# Altium schematic sheet Opto_inputs.SchDoc
size A4; SheetNumber: 2; SheetTotal: 8
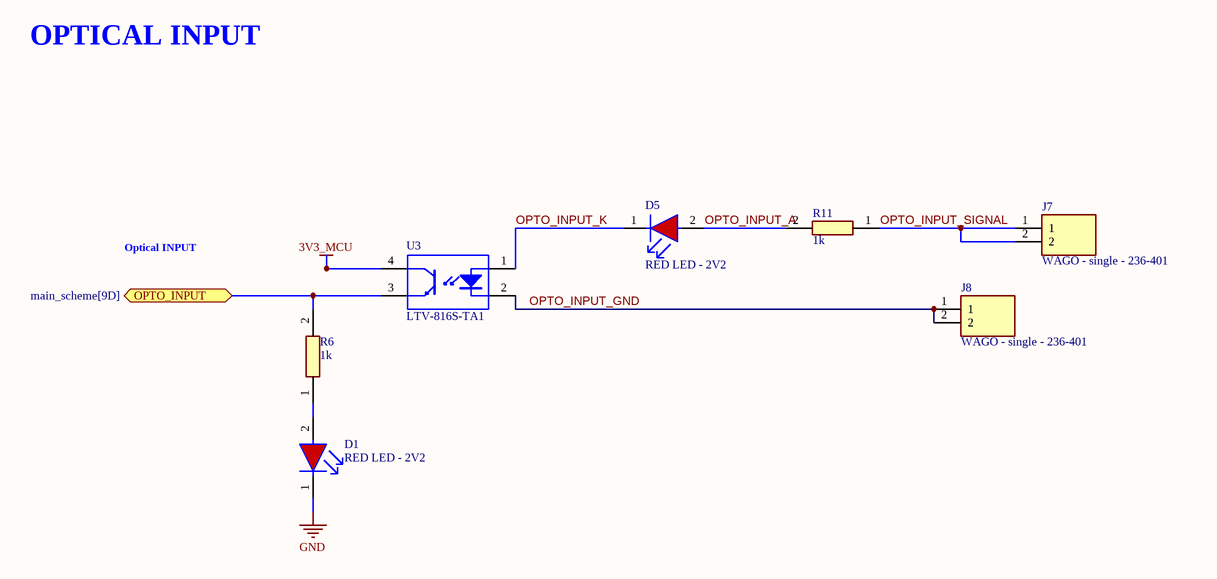
[diagram p0: Opto_inputs.SchDoc]

## Parts
D1  RED LED - 2V2  [0603_RED_LED]
D5  RED LED - 2V2  [0603_RED_LED]
J7  WAGO - single - 236-401  [WAGO-236-601]
J8  WAGO - single - 236-401  [WAGO-236-601]
R6  1k  [0603- SMD resistor]
R11  1k  [0603- SMD resistor]
U3  LTV-816S-TA1  [LTST-LTV-816S_V]

## Ports
OPTO_INPUT (bidir, see main_scheme[9D])

## Nets
3V3_MCU: U3.4(COLLECTOR)
GND: D1.1(C)
OPTO_INPUT: R6.2 U3.3(EMITTER) ; port OPTO_INPUT
OPTO_INPUT_A: D5.2(A) R11.2
OPTO_INPUT_GND: J8.1 J8.2 U3.2(CATHODE)
OPTO_INPUT_K: D5.1(C) U3.1(ANODE)
OPTO_INPUT_SIGNAL: J7.1 J7.2 R11.1
NetD1_2: D1.2(A) R6.1

## Notes on the sheet
- OPTICAL INPUT
- Optical INPUT

## Library data of the parts
D1 D5 = LED - 0603 - RED - 2V2: LED RED DIFFUSED 0603 SMD; PartNumber: SML-D12U1WT86; Value: RED LED - 2.2V; Package: 0602; ComponentLink1Description: myLinks; ComponentLink1URL: https://cz.mouser.com/ProductDetail/ROHM-Semiconductor/SML-D12U1WT86?qs=M3jcYzEJUdEySuGkbjHEtQ%3D%3D; Supplier 1: Mouser; Supplier Part Number 1: 755-SML-D12U1WT86
J7 J8 = WAGO - single - 236-401: Wago connector - PCB to wire - single - 24A 320V; ComponentLink1Description: myLinks; ComponentLink1URL: https://cz.farnell.com/wago/236-401/terminal-block-wire-to-brd-1pos/dp/1891620?gclid=CjwKCAiAu5agBhBzEiwAdiR5tFj9uwuLgrlShO914YuSUEtsU0o4Hiox7ZjRnpSnFBbtyRYLbKYJWxoC0xgQAvD_BwE&mckv=sEoohdYPd_dc|pcrid|263733373421|kword|+wago%20+236-401|match|b|plid||slid||product||pgrid|56870816529|ptaid|kwd-298399736559|&CMP=KNC-GCZ-GEN-SKU-MDC; Value: 24A 320V; Package: 236-401; PartNumber: 236-401; Supplier 1: Farnell; Supplier Part Number 1: 1891620
R6 R11 = RESISTOR - 0603 - 1k: Resistor 0603 1KR 100mW 1%; PartNumber: RT0603FRE071KL; ComponentLink1Description: myLinks; ComponentLink1URL: https://cz.mouser.com/ProductDetail/YAGEO/RT0603FRE071KL?qs=8cPjvKtxWv68ZVEzoi6JxQ%3D%3D; Value: 1k; Package: 0603; Supplier 1: Mouser; Supplier Part Number 1: 603-RT0603FRE071KL
U3 = OPTO - 50mA - 80V: Photocoupler, 50 mA, -30 to 110 degC, 4-Pin SMD, RoHS, Tape and Reel; Value: output 80V 50mA, Input  1.2V; ComponentLink1Description: myLinks; ComponentLink1URL: https://cz.mouser.com/ProductDetail/Lite-On/LTV-816S-TA1?qs=gnaPJ2cis715Sm%2FgFsy6%2FQ%3D%3D; PartNumber: LTV-816S-TA1; Package: PDIP-4 Gull Wing; Supplier 1: Mouser; Supplier Part Number 1: 859-LTV-816S-TA1